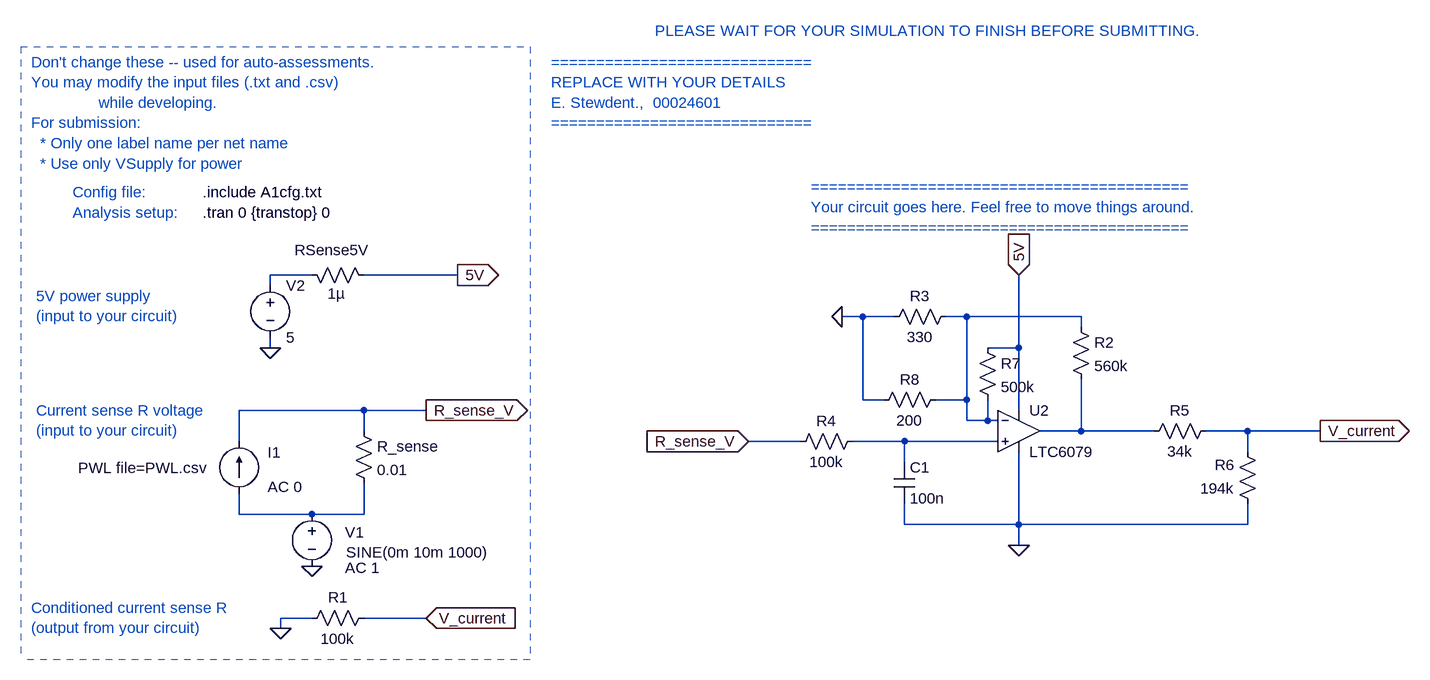
[diagram p0: schematic E344_23575786_A1.asc]
E344_23575786_A1.asc, the LTspice schematic file:
Version 4
SHEET 1 3140 2124
WIRE -1920 -1072 -1984 -1072
WIRE -1696 -1072 -1840 -1072
WIRE -1984 -1056 -1984 -1072
WIRE -1072 -1008 -1104 -1008
WIRE -1024 -1008 -1072 -1008
WIRE -912 -1008 -944 -1008
WIRE -736 -1008 -912 -1008
WIRE -736 -992 -736 -1008
WIRE -1984 -960 -1984 -976
WIRE -832 -960 -832 -1072
WIRE -832 -960 -880 -960
WIRE -1072 -880 -1072 -1008
WIRE -1040 -880 -1072 -880
WIRE -912 -880 -912 -1008
WIRE -912 -880 -960 -880
WIRE -1840 -864 -2032 -864
WIRE -1744 -864 -1840 -864
WIRE -832 -864 -832 -960
WIRE -912 -848 -912 -880
WIRE -880 -848 -880 -880
WIRE -880 -848 -912 -848
WIRE -864 -848 -880 -848
WIRE -1840 -832 -1840 -864
WIRE -736 -832 -736 -912
WIRE -736 -832 -800 -832
WIRE -624 -832 -736 -832
WIRE -480 -832 -544 -832
WIRE -368 -832 -480 -832
WIRE -2032 -816 -2032 -864
WIRE -1168 -816 -1248 -816
WIRE -1008 -816 -1088 -816
WIRE -864 -816 -1008 -816
WIRE -480 -800 -480 -832
WIRE -1008 -784 -1008 -816
WIRE -2032 -704 -2032 -736
WIRE -1920 -704 -2032 -704
WIRE -1840 -704 -1840 -752
WIRE -1840 -704 -1920 -704
WIRE -1008 -688 -1008 -720
WIRE -832 -688 -832 -800
WIRE -832 -688 -1008 -688
WIRE -480 -688 -480 -720
WIRE -480 -688 -832 -688
WIRE -832 -656 -832 -688
WIRE -1920 -544 -1968 -544
WIRE -1744 -544 -1840 -544
WIRE -1968 -528 -1968 -544
FLAG -1696 -1072 5V
IOPIN -1696 -1072 Out
FLAG -1984 -960 0
FLAG -832 -1072 5V
IOPIN -832 -1072 In
FLAG -1744 -864 R_sense_V
IOPIN -1744 -864 Out
FLAG -1920 -624 0
FLAG -368 -832 V_current
IOPIN -368 -832 Out
FLAG -1248 -816 R_sense_V
IOPIN -1248 -816 In
FLAG -1744 -544 V_current
IOPIN -1744 -544 In
FLAG -1968 -528 0
FLAG -832 -656 0
FLAG -1104 -1008 0
SYMBOL voltage -1984 -1072 R0
WINDOW 123 0 0 Left 0
WINDOW 39 0 0 Left 0
SYMATTR InstName V2
SYMATTR Value 5
SYMBOL res -1936 -1088 M90
WINDOW 0 -7 47 VBottom 2
WINDOW 3 29 54 VTop 2
SYMATTR InstName RSense5V
SYMATTR Value 1µ
SYMBOL res -1856 -848 R0
SYMATTR InstName R_sense
SYMATTR Value 0.01
SYMBOL current -2032 -736 R180
WINDOW 0 -64 63 Left 2
WINDOW 3 248 39 Right 2
WINDOW 123 -97 10 Left 2
WINDOW 39 0 0 Left 0
SYMATTR InstName I1
SYMATTR Value PWL file=PWL.csv
SYMATTR Value2 AC 0
SYMBOL voltage -1920 -720 R0
WINDOW 0 66 60 Bottom 2
WINDOW 3 163 59 Top 2
WINDOW 123 78 114 Bottom 2
WINDOW 39 0 0 Left 0
SYMATTR InstName V1
SYMATTR Value SINE(0m 10m 1000)
SYMATTR Value2 AC 1
SYMBOL res -1824 -560 R90
WINDOW 0 0 56 VBottom 2
WINDOW 3 32 56 VTop 2
SYMATTR InstName R1
SYMATTR Value 100k
SYMBOL OpAmps\\LTC6079 -832 -832 R0
SYMATTR InstName U2
SYMBOL res -752 -1008 R0
SYMATTR InstName R2
SYMATTR Value 560k
SYMBOL res -928 -1024 R90
WINDOW 0 0 56 VBottom 2
WINDOW 3 32 56 VTop 2
SYMATTR InstName R3
SYMATTR Value 330
SYMBOL res -1072 -832 R90
WINDOW 0 0 56 VBottom 2
WINDOW 3 32 56 VTop 2
SYMATTR InstName R4
SYMATTR Value 100k
SYMBOL cap -1024 -784 R0
SYMATTR InstName C1
SYMATTR Value 100n
SYMBOL res -528 -848 R90
WINDOW 0 0 56 VBottom 2
WINDOW 3 32 56 VTop 2
SYMATTR InstName R5
SYMATTR Value 34k
SYMBOL res -464 -704 R180
WINDOW 0 36 76 Left 2
WINDOW 3 36 40 Left 2
SYMATTR InstName R6
SYMATTR Value 194k
SYMBOL res -896 -976 R0
SYMATTR InstName R7
SYMATTR Value 500k
SYMBOL res -944 -896 R90
WINDOW 0 0 56 VBottom 2
WINDOW 3 32 56 VTop 2
SYMATTR InstName R8
SYMATTR Value 200
TEXT -2088 -1168 Left 2 !.tran 0 {transtop} 0
TEXT -2088 -1200 Left 2 !.include A1cfg.txt
TEXT -2352 -1400 Left 2 ;Don't change these -- used for auto-assessments.\nYou may modify the input files (.txt and .csv) \n               while developing.\nFor submission: \n  * Only one label name per net name\n  * Use only VSupply for power
TEXT -2288 -1200 Left 2 ;Config file:
TEXT -2288 -1168 Left 2 ;Analysis setup:
TEXT -1552 -1400 Left 2 ;=============================\nREPLACE WITH YOUR DETAILS\nE. Stewdent.,  00024601\n=============================
TEXT -1152 -1208 Left 2 ;==========================================\nYour circuit goes here. Feel free to move things around. \n==========================================
TEXT -1392 -1448 Left 2 ;PLEASE WAIT FOR YOUR SIMULATION TO FINISH BEFORE SUBMITTING.
TEXT -2344 -1040 Left 2 ;5V power supply\n(input to your circuit)
TEXT -2344 -864 Left 2 ;Current sense R voltage\n(input to your circuit)
TEXT -2352 -560 Left 2 ;Conditioned current sense R\n(output from your circuit)
LINE Normal -1584 -1424 -1584 -480 2
LINE Normal -2368 -1424 -1584 -1424 2
LINE Normal -1584 -480 -2368 -480 2
LINE Normal -1584 -496 -1584 -496 2
LINE Normal -2368 -1424 -2368 -480 2

The netlist it stands for:
* E344_23575786_A1.asc
V2 N001 0 5
RSense5V N001 5V 1µ
R_sense R_sense_V N005 0.01
I1 N005 R_sense_V PWL file=PWL.csv AC 0
V1 N005 0 SINE(0m 10m 1000) AC 1
R1 V_current 0 100k
XU2 N004 N002 5V 0 N003 LTC6078  ; LTC6079, pins In+ In- V+ V- OUT
R2 N002 N003 560k
R3 N002 0 330
R4 N004 R_sense_V 100k
C1 N004 0 100n
R5 V_current N003 34k
R6 0 V_current 194k
R7 5V N002 500k
R8 N002 0 200
.tran 0 {transtop} 0
.include A1cfg.txt
* Don't change these -- used for auto-assessments.
* You may modify the input files (.txt and .csv)
*                while developing.
* For submission:
*   * Only one label name per net name
*   * Use only VSupply for power
* Config file:
* Analysis setup:
* =============================
* REPLACE WITH YOUR DETAILS
* E. Stewdent.,  00024601
* =============================
* ==========================================
* Your circuit goes here. Feel free to move things around.
* ==========================================
* PLEASE WAIT FOR YOUR SIMULATION TO FINISH BEFORE SUBMITTING.
* 5V power supply
* (input to your circuit)
* Current sense R voltage
* (input to your circuit)
* Conditioned current sense R
* (output from your circuit)
.lib LTC5.lib
.backanno
.end